# EAGLE design detached-display-board (EAGLE 7.5.0)
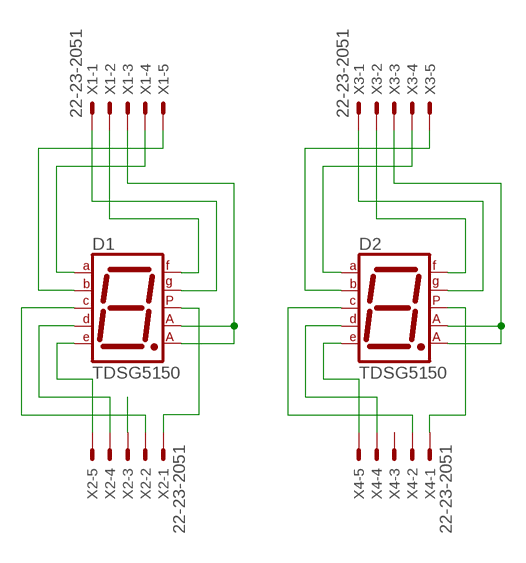
[diagram p0: schematic, sheet 1]

## Parts
D1  TDSG5150  7SEG-CA  [7SEG-13]
D2  TDSG5150  7SEG-CA  [7SEG-13]
X1  22-23-2051  [22-23-2051]
X2  22-23-2051  [22-23-2051]
X3  22-23-2051  [22-23-2051]
X4  22-23-2051  [22-23-2051]

## Nets
N$1: D1.1(E) X2.5
N$2: D1.2(D) X2.4
N$3: D2.1(E) X4.5
N$4: D2.2(D) X4.4
N$5: D1.4(C) X2.2
N$6: D1.5(DP) X2.1
N$7: D2.4(C) X4.2
N$8: D2.5(DP) X4.1
N$9: D1.10(G) X1.1
N$10: D2.10(G) X3.1
N$11: D1.9(F) X1.2
N$12: D2.9(F) X3.2
N$13: D1.3(CA1) D1.8(CA2) X1.3
N$14: D2.3(CA1) D2.8(CA2) X3.3
N$15: D1.7(A) X1.4
N$16: D2.7(A) X3.4
N$17: D1.6(B) X1.5
N$18: D2.6(B) X3.5
N$19: X2.3
Unconnected: X4.3

## Library data of the parts
D1 D2 = special:7SEG-CA: 7-segment DISPLAY single anode, 13 mm
X1-X4 = con-molex:22-23-2051: .100" (2.54mm) Center Header - 5 Pin; MF: MOLEX; MPN: 22-23-2051; OC_FARNELL: 1462952; OC_NEWARK: 38C9178

## Board
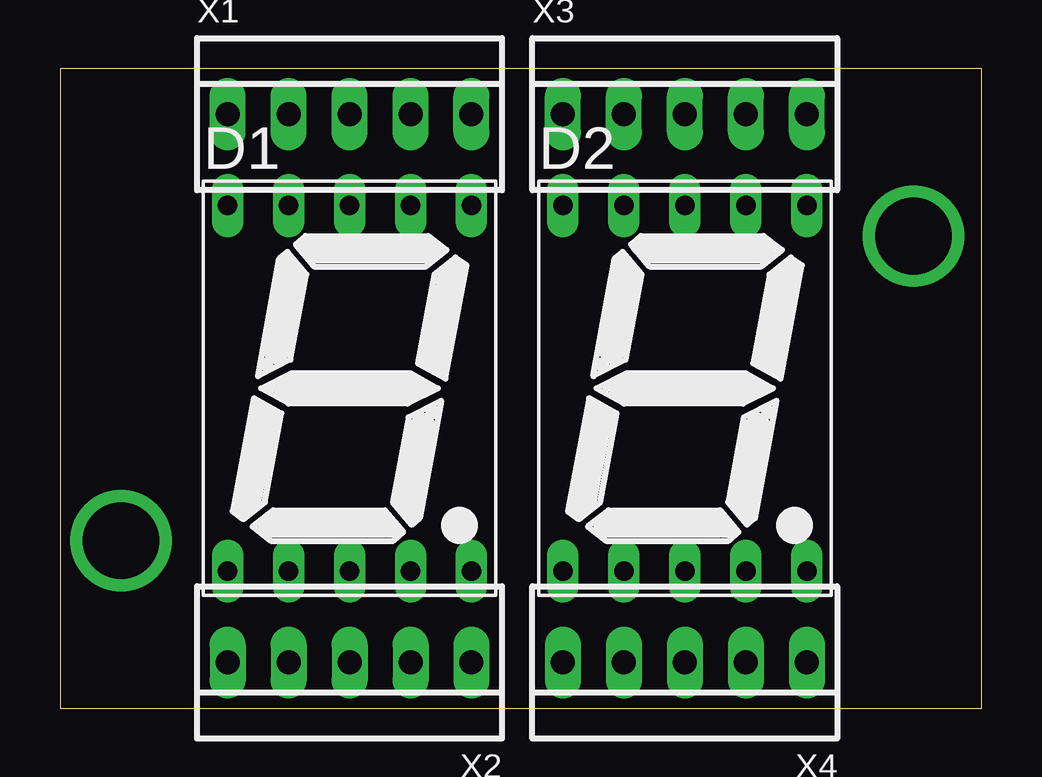
[diagram p1: board, top side]
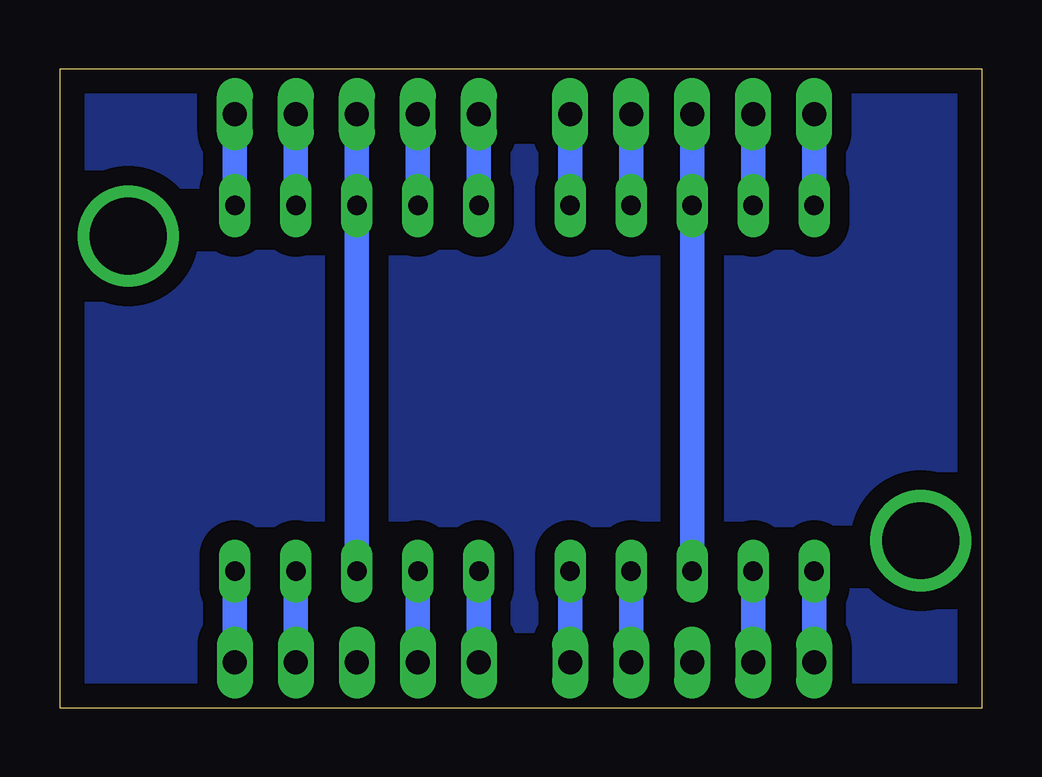
[diagram p2: board, bottom side, seen from below]

Size 38.41 x 26.66 mm. Coordinates in mm from the lower left corner, seen from the top.
Outline: 0,0 38.41,0 38.41,26.66 0,26.66 0,0
Copper layers (1*16): Top 0.035mm / dielectric 1.5mm / Bottom 0.035mm
Design rules "default": minimum track width 10mil, minimum drill 24mil, track to track 8mil, track to pad 8mil, pad to pad 8mil, via to via 8mil, smd to smd 8mil, copper to edge 40mil, drill to drill 8mil, minimum pad ring 10mil, minimum via ring 8mil, stop-mask expansion 4mil, vias tented up to drill 0mil, thermal gap 10mil

### Footprints (pad centres in the part's own frame; a part is rotated, then mirrored left to right if it is on the bottom)
7SEG-13 = drill 0.813 long: 1 -5.08,-7.62; 2 -2.54,-7.62; 3 0,-7.62; 4 2.54,-7.62; 5 5.08,-7.62; 6 5.08,7.62; 7 2.54,7.62; 8 0,7.62; 9 -2.54,7.62; 10 -5.08,7.62
22-23-2051 = drill 1 long: 1 -5.08,0; 2 -2.54,0; 3 0,0; 4 2.54,0; 5 5.08,0

### Placement (x,y rotation side)
D1  12.06,13.34 0 top
D2  26.04,13.34 0 top
X1  12.06,24.77 0 top
X2  12.06,1.91 180 top
X3  26.04,24.77 0 top
X4  26.04,1.91 180 top

### Tracks (layer width: path | path; a pad name or v marks a point on that pad's centre or on a via)
N$1
  Bottom 1.016: D1.1 X2.5
N$2
  Bottom 1.016: D1.2 X2.4
N$3
  Bottom 1.016: D2.1 X4.5
N$4
  Bottom 1.016: D2.2 X4.4
N$5
  Bottom 1.016: D1.4 X2.2
N$6
  Bottom 1.016: D1.5 X2.1
N$7
  Bottom 1.016: D2.4 X4.2
N$8
  Bottom 1.016: D2.5 X4.1
N$9
  Bottom 1.016: X1.1 D1.10
N$10
  Bottom 1.016: X3.1 D2.10
N$11
  Bottom 1.016: X1.2 D1.9
N$12
  Bottom 1.016: X3.2 D2.9
N$13
  Bottom 1.016: X1.3 D1.8 D1.3
N$14
  Bottom 1.016: X3.3 D2.8 D2.3
N$15
  Bottom 1.016: X1.4 D1.7
N$16
  Bottom 1.016: X3.4 D2.7
N$17
  Bottom 1.016: X1.5 D1.6
N$18
  Bottom 1.016: X3.5 D2.6
N$20  (via drill 3.2)
  other vias: 2.54,6.99
N$21  (via drill 3.2)
  other vias: 35.56,19.68
N$22
  pour Bottom (isolate 0.813): 0.64,27.94 38.1,27.94 38.1,-1.27 0.64,-1.27